# EAGLE design ttl_rs485_fd_v1 (EAGLE 5.07)
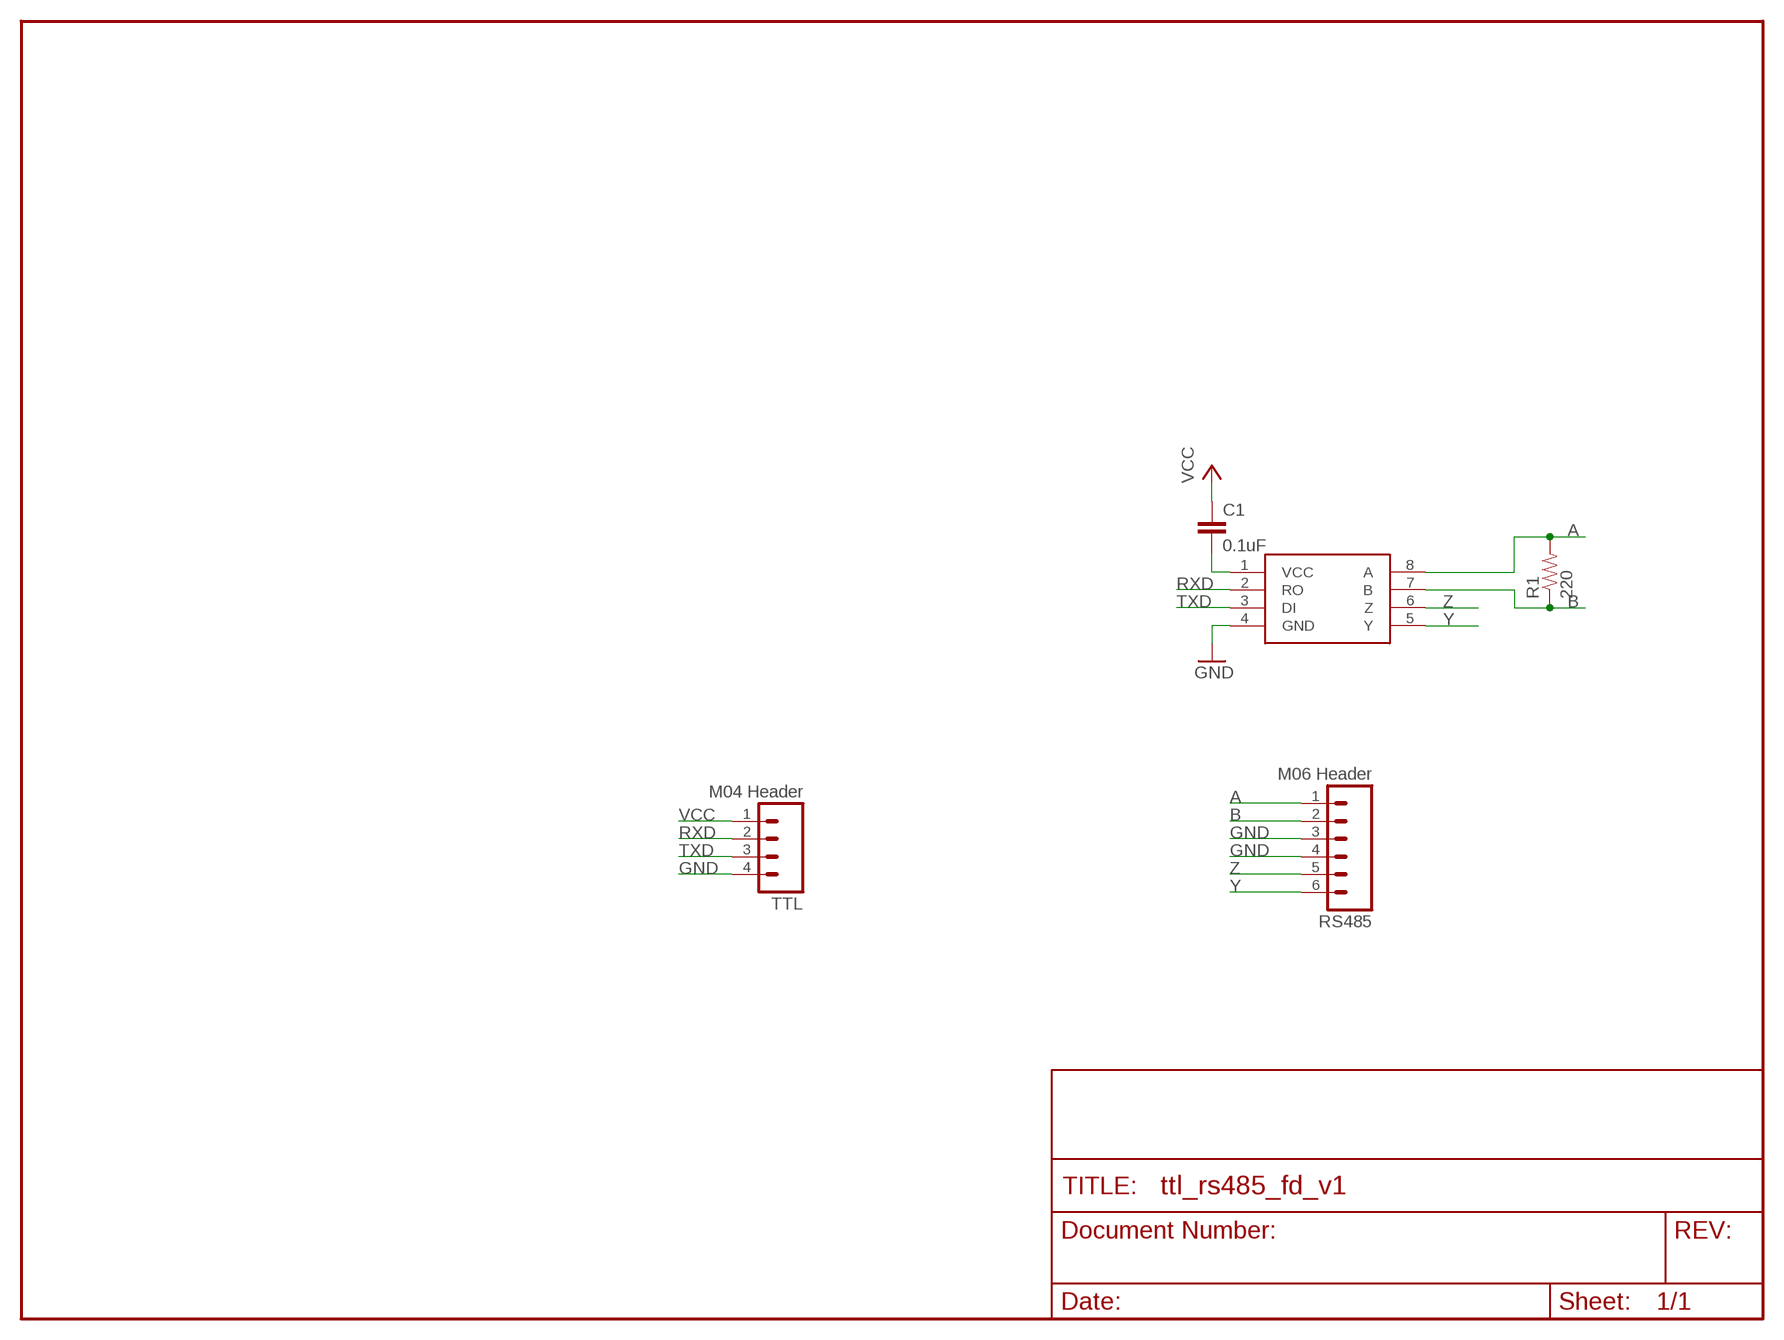
[diagram p0: schematic, sheet 1]

## Parts
C1  0.1uF  CAP0603-CAP  [0603-CAP]
MAX3077  MAX3087  [SO08]
R1  220  RESISTOR0603-RES  [0603-RES]
RS485  M06 Header  M06SIP  [1X06]
TTL  M04 Header  M04PTH  [1X04]

## Nets
A: MAX3077.8(A) R1.2 RS485.1
B: MAX3077.7(B) R1.1 RS485.2
GND [supply]: MAX3077.4(GND) RS485.3 RS485.4 TTL.4
N$1: C1.2 MAX3077.1(VCC)
RXD: MAX3077.2(RO) TTL.2
TXD: MAX3077.3(DI) TTL.3
VCC [supply]: C1.1 TTL.1
Y: MAX3077.5(Y) RS485.6
Z: MAX3077.6(Z) RS485.5

## Library data of the parts
C1 = SparkFun:CAP: Capacitor Standard 0603 ceramic capacitor, and 0.1" leaded capacitor.
MAX3077 = jcole:MAX3087
R1 = SparkFun:RESISTOR: Resistor Basic schematic elements and footprints for 0603, 1206, and PTH 1/10th watt (small) resistors.
RS485 = SparkFun:M06: Header 6 Standard 6-pin 0.1" header. Use with straight break away headers (SKU : PRT-00116), right angle break away headers (PRT-00553), swiss pins (PRT-00743), machine pins (PRT-00117), and female headers (PRT-00115). Molex polarized connector foot print use with SKU : PRT-08094 with associated crimp pins and housings. NOTES ON THE VARIANTS LOCK and LOCK_LONGPADS... This footprint was designed to help hold the alignment of a through-hole component (i.e. 6-pin header) while soldering it into place. You may notice that each hole has been shifted either up or down by 0.005 of an inch from it's more standard position (which is a perfectly straight line). This slight alteration caused the pins (the squares in the middle) to touch the edges of the holes. Because they are alternating, it causes a "brace" to hold the component in place. 0.005 has proven to be the perfect amount of "off-center" position when using our standard breakaway headers. Although looks a little odd when you look at the bare footprint, once you have a header in there, the alteration is very hard to notice. Also, if you push a header all the way into place, it is covered up entirely on the bottom side. This idea of altering the position of holes to aid alignment will be further integrated into the Sparkfun Library for other footprints. It can help hold any component with 3 or more connection pins.
TTL = SparkFun:M04: Header 4 Standard 4-pin 0.1" header. Use with straight break away headers (SKU : PRT-00116), right angle break away headers (PRT-00553), swiss pins (PRT-00743), machine pins (PRT-00117), and female headers (PRT-00115). Molex polarized connector foot print use with SKU : PRT-08231 with associated crimp pins and housings.

## Net classes
0 signal: width 0.203 mm
1 supply: width 0.305 mm

## Board
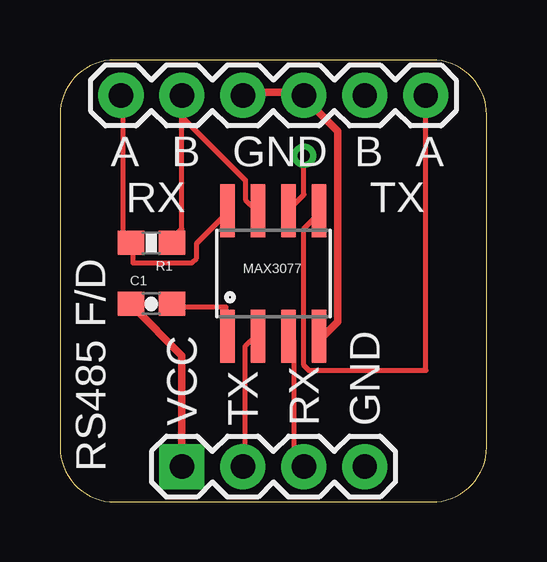
[diagram p1: board, top side]
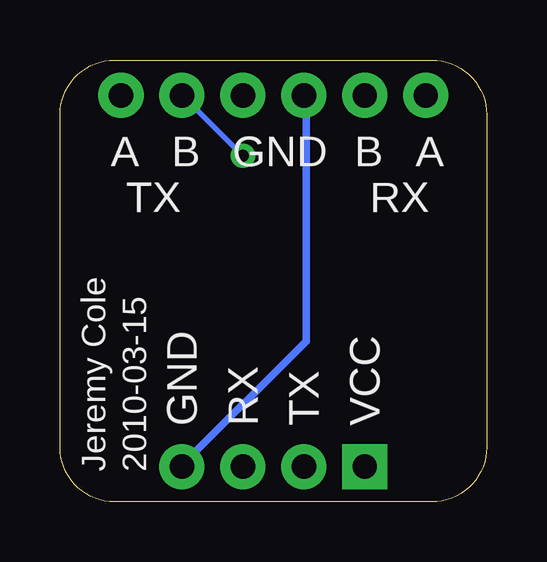
[diagram p2: board, bottom side, seen from below]

Size 17.78 x 18.41 mm. Coordinates in mm from the lower left corner, seen from the top.
Outline: 15.49,0 arc90 17.78,2.29 17.78,16.12 arc90 15.49,18.41 2.29,18.41 arc90 0,16.12 0,2.29 arc90 2.29,0 15.49,0
Copper layers (1*16): Top 0.035mm / dielectric 1.5mm / Bottom 0.035mm
Design rules "SparkFun": minimum track width 8mil, minimum drill 20mil, track to track 8mil, track to pad 8mil, pad to pad 8mil, via to via 8mil, smd to smd 8mil, copper to edge 10mil, drill to drill 8mil, minimum pad ring 12mil, minimum via ring 10mil, stop-mask expansion 4mil, vias tented up to drill 25mil, thermal gap 10mil

### Footprints (pad centres in the part's own frame; a part is rotated, then mirrored left to right if it is on the bottom)
0603-CAP = smd 1.1 x 1: 1 -0.85,0; 2 0.85,0
SO08 = smd 0.61 x 2.21: 1 -1.905,-2.616; 2 -0.635,-2.616; 3 0.635,-2.616; 4 1.905,-2.616; 5 1.905,2.616; 6 0.635,2.616; 7 -0.635,2.616; 8 -1.905,2.616
0603-RES = smd 1.1 x 1: 1 -0.85,0; 2 0.85,0
1X06 = drill 1.016 pad 1.88 round: 1 0,0; 2 2.54,0; 3 5.08,0; 4 7.62,0; 5 10.16,0; 6 12.7,0
1X04 = drill 1.016 pad 1.88 square: 1 0,0 | drill 1.016 pad 1.88 round: 2 2.54,0; 3 5.08,0; 4 7.62,0

### Placement (x,y rotation side)
C1  3.81,8.26 0 top
MAX3077  8.89,9.53 0 top
R1  3.81,10.79 180 top
RS485  2.54,16.94 0 top
TTL  5.08,1.47 0 top

### Tracks (layer width: path | path; a pad name or v marks a point on that pad's centre or on a via)
A
  Top 0.203: RS485.1 2.64,16.87 2.64,11.18 2.85,10.97 R1.2 3.05,10.77 3.05,9.96 5.49,9.96 5.69,10.16 5.69,10.77 6.91,11.99 MAX3077.8
B
  Top 0.203: 5.08,16.05 5.08,11.38 4.67,10.97 R1.1 | 5.08,16.05 RS485.2 5.08,16.87 | 5.08,16.05 7.72,13.41 7.72,12.6 8.13,12.19 MAX3077.7
GND
  Top 0.305: MAX3077.4 10.97,6.91 11.58,7.52 11.58,15.44 10.16,16.87 RS485.4 10.16,17.07 7.72,17.07 RS485.3
  Bottom 0.305: TTL.4 12.6,1.63 7.52,6.71 7.52,16.87 RS485.3
N$1
  Top 0.203: C1.2 4.67,8.13 6.91,8.13 6.91,6.91 MAX3077.1
RXD
  Top 0.203: MAX3077.2 8.13,6.91 7.72,6.5 7.72,1.63 TTL.2
TXD
  Top 0.203: MAX3077.3 9.55,6.91 9.75,6.71 9.75,2.03 10.16,1.63 TTL.3
VCC
  Top 0.305: C1.1 3.05,8.13 5.08,6.1 TTL.1
Y
  Top 0.203: MAX3077.5 10.77,11.99 10.16,11.38 10.16,5.69 10.36,5.49 15.24,5.49 RS485.6
Z  (via drill 0.51)
  Top 0.203: v10.16,14.43 10.16,12.8 9.55,12.19 MAX3077.6
  Bottom 0.203: v10.16,14.43 12.6,16.87 RS485.5

### Text on the board
tNames: A | B | GND | B | A | RX | TX | VCC | TX | RX | GND | RS485 F/D
bNames: A | B | GND | B | A | RX | TX | VCC | TX | RX | GND | 2010-03-15 | Jeremy Cole